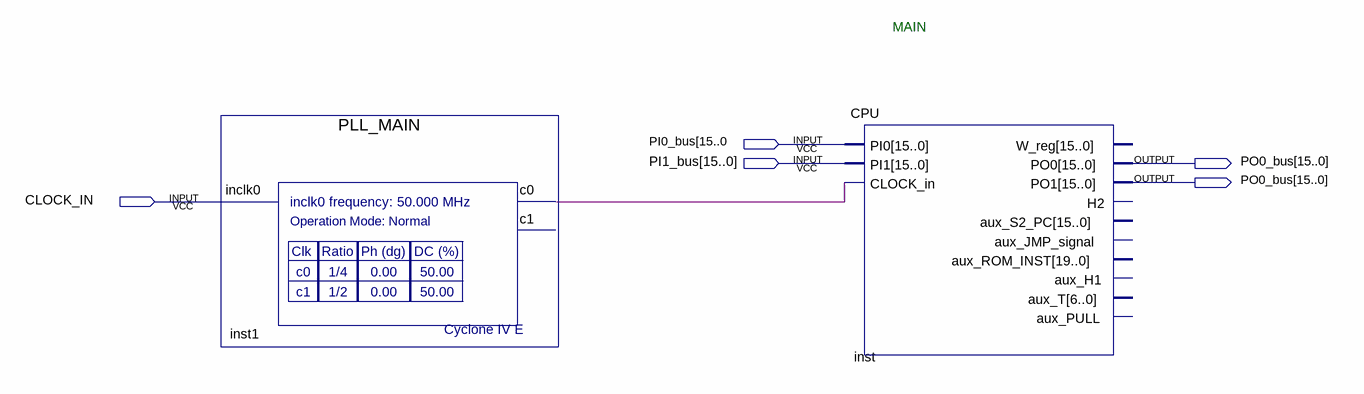
[diagram p0: schematic sheet]
// Quartus schematic MAIN.bdf as structural Verilog: 2 symbols, 5 pins
module MAIN (
  input  \PI0_bus[15..0 ,
  input  [15:0] PI1_bus,
  input  CLOCK_IN,
  output [15:0] PO0_bus
);

  wire inst1_c0;

  PLL_MAIN inst1 (.inclk0(CLOCK_IN), .c0(inst1_c0));  // open: c1
  CPU inst (
    .PI0({16{\PI0_bus[15..0 }}), .PI1(PI1_bus), .CLOCK_in(inst1_c0), .PO0(PO0_bus), .PO1(PO0_bus));  // open: W_reg, H2, aux_S2_PC, aux_JMP_signal, aux_ROM_INST, aux_H1, aux_T, aux_PULL

  // Notes on the sheet:
  //   MAIN
endmodule
